# EAGLE design ShifterDial (EAGLE 9.6.2)
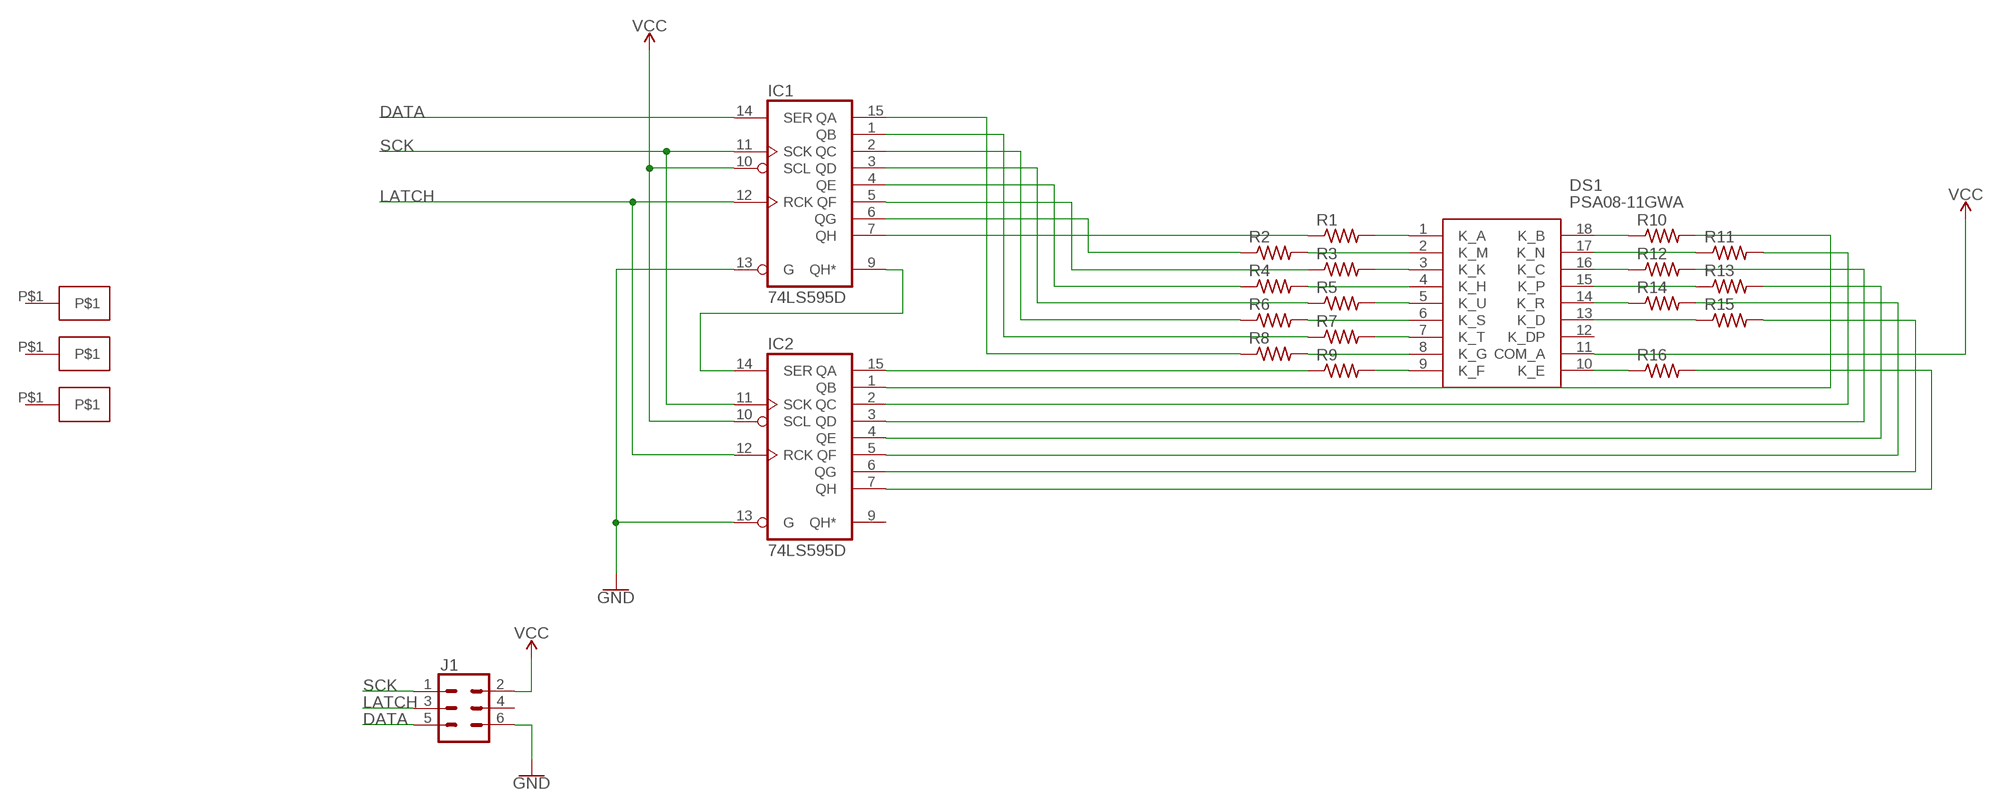
[diagram p0: schematic, sheet 1]

## Parts
DS1  PSA08-11GWA  [PSA0811GWA]
IC1  74LS595D  [SO16]
IC2  74LS595D  [SO16]
J1  CONN_03X2SHROUD  [2X3-SHROUDED]
R1  R-US_R0603  [R0603]
R2  R-US_R0603  [R0603]
R3  R-US_R0603  [R0603]
R4  R-US_R0603  [R0603]
R5  R-US_R0603  [R0603]
R6  R-US_R0603  [R0603]
R7  R-US_R0603  [R0603]
R8  R-US_R0603  [R0603]
R9  R-US_R0603  [R0603]
R10  R-US_R0603  [R0603]
R11  R-US_R0603  [R0603]
R12  R-US_R0603  [R0603]
R13  R-US_R0603  [R0603]
R14  R-US_R0603  [R0603]
R15  R-US_R0603  [R0603]
R16  R-US_R0603  [R0603]
U$1  KEYSTONEM3  [M3SMDSTANDOFF]
U$2  KEYSTONEM3  [M3SMDSTANDOFF]
U$3  KEYSTONEM3  [M3SMDSTANDOFF]

## Nets
DATA: IC1.14(SER) J1.5
GND: IC1.13(G) IC2.13(G) J1.6
LATCH: IC1.12(RCK) IC2.12(RCK) J1.3
N$1: IC1.9(QH*) IC2.14(SER)
N$2: DS1.1(K_A) R1.2
N$3: DS1.2(K_M) R2.2
N$4: DS1.3(K_K) R3.2
N$5: DS1.4(K_H) R4.2
N$6: DS1.5(K_U) R5.2
N$7: DS1.6(K_S) R6.2
N$8: DS1.7(K_T) R7.2
N$9: DS1.8(K_G) R8.2
N$10: DS1.9(K_F) R9.2
N$11: DS1.18(K_B) R10.1
N$12: DS1.17(K_N) R11.1
N$13: DS1.16(K_C) R12.1
N$14: DS1.15(K_P) R13.1
N$15: DS1.14(K_R) R14.1
N$16: DS1.13(K_D) R15.1
N$17: DS1.10(K_E) R16.1
N$18: IC1.7(QH) R1.1
N$19: IC1.6(QG) R2.1
N$20: IC1.5(QF) R3.1
N$21: IC1.4(QE) R4.1
N$22: IC1.3(QD) R5.1
N$23: IC1.2(QC) R6.1
N$24: IC1.1(QB) R7.1
N$25: IC1.15(QA) R8.1
N$26: IC2.6(QG) R15.2
N$27: IC2.7(QH) R16.2
N$28: IC2.1(QB) R10.2
N$29: IC2.2(QC) R11.2
N$30: IC2.3(QD) R12.2
N$31: IC2.4(QE) R13.2
N$32: IC2.5(QF) R14.2
N$34: IC2.15(QA) R9.1
SCK: IC1.11(SCK) IC2.11(SCK) J1.1
VCC: DS1.11(COM_A) IC1.10(SCL) IC2.10(SCL) J1.2
Unconnected: DS1.12(K_DP) IC2.9(QH*) J1.4 U$1.P$1 U$2.P$1 U$3.P$1

## Power pins joined to a net without a drawn wire
GND: IC1.8(GND) IC2.8(GND)
VCC: IC1.16(VCC) IC2.16(VCC)

## Library data of the parts
DS1 = PSA08-11GWA:PSA08-11GWA: LED Displays & Accessories AlphaNum Grn 568nm Common Anode Source: Datasheet <https://componentsearchengine.com/Datasheets/1/PSA08-11GWA.pdf>; DESCRIPTION: LED Displays & Accessories AlphaNum Grn 568nm Common Anode; HEIGHT: 8.75mm; MANUFACTURER_NAME: Kingbright; MANUFACTURER_PART_NUMBER: PSA08-11GWA; MOUSER_PART_NUMBER: 604-PSA08-11GWA; MOUSER_PRICE-STOCK: https://www.mouser.co.uk/ProductDetail/Kingbright/PSA08-11GWA?qs=VdjlWU%2FzoOGXetunvhrCIw%3D%3D
IC1 IC2 = 74xx-us:74*595: 8-bit SHIFT REGISTER, output latch
J1 = SparkFun-Connectors:CONN_03X2: Multi connection point. Often used as Generic Header-pin footprint for 0.1 inch spaced/style header connections You can populate with any combo of single row headers, but if you'd like an exact match, check these: Header - 2x3 (Male, 0.1") <https://www.sparkfun.com/products/12807> (PRT-12807) Header - 2x3 (Female, 0.1") <https://www.sparkfun.com/products/13010> (PRT-13010) 2x3 Pin Shrouded Header <https://www.sparkfun.com/products/10877> (PRT-10877) On any of the 0.1 inch spaced packages, you can populate with these: Break Away Headers - Straight <https://www.sparkfun.com/products/116> (PRT-00116) Break Away Male Headers - Right Angle <https://www.sparkfun.com/products/553> (PRT-00553) Female Headers <https://www.sparkfun.com/products/115> (PRT-00115) Break Away Headers - Machine Pin <https://www.sparkfun.com/products/117> (PRT-00117) Break Away Female Headers - Swiss Machine Pin <https://www.sparkfun.com/products/743> (PRT-00743) Special note: the shrouded connector mates well with our 3x2 ribbon cables: Ribbon Crimp Connector - 6-pin (2x3, Female) <https://www.sparkfun.com/products/10651> (PRT-10651) Ribbon Cable - 6 wire (15ft) <https://www.sparkfun.com/products/10646> (PRT-10646); PROD_ID: CONN-10681; SF_ID: PRT_10877
R1-R16 = rcl:R-US_: RESISTOR, American symbol; SPICEPREFIX: R
U$1-U$3 = KeystoneSMD:KEYSTONEM3

## Board
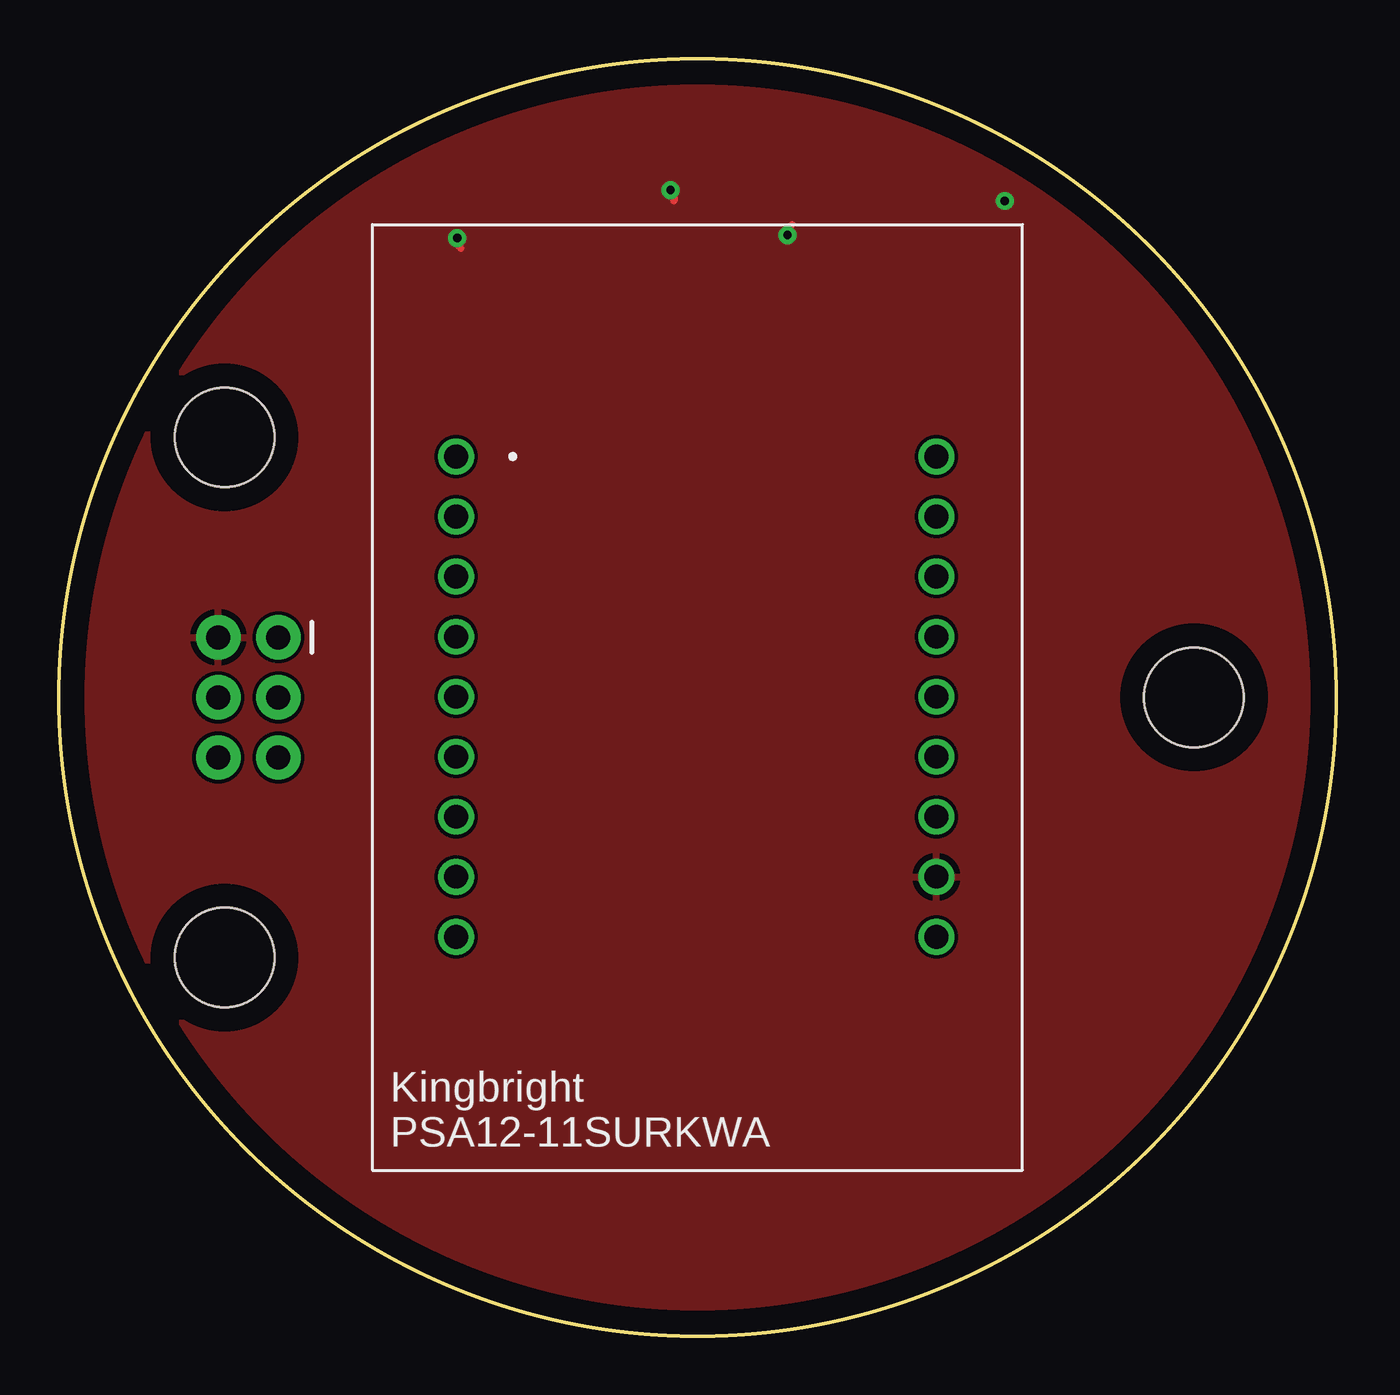
[diagram p1: board, top side]
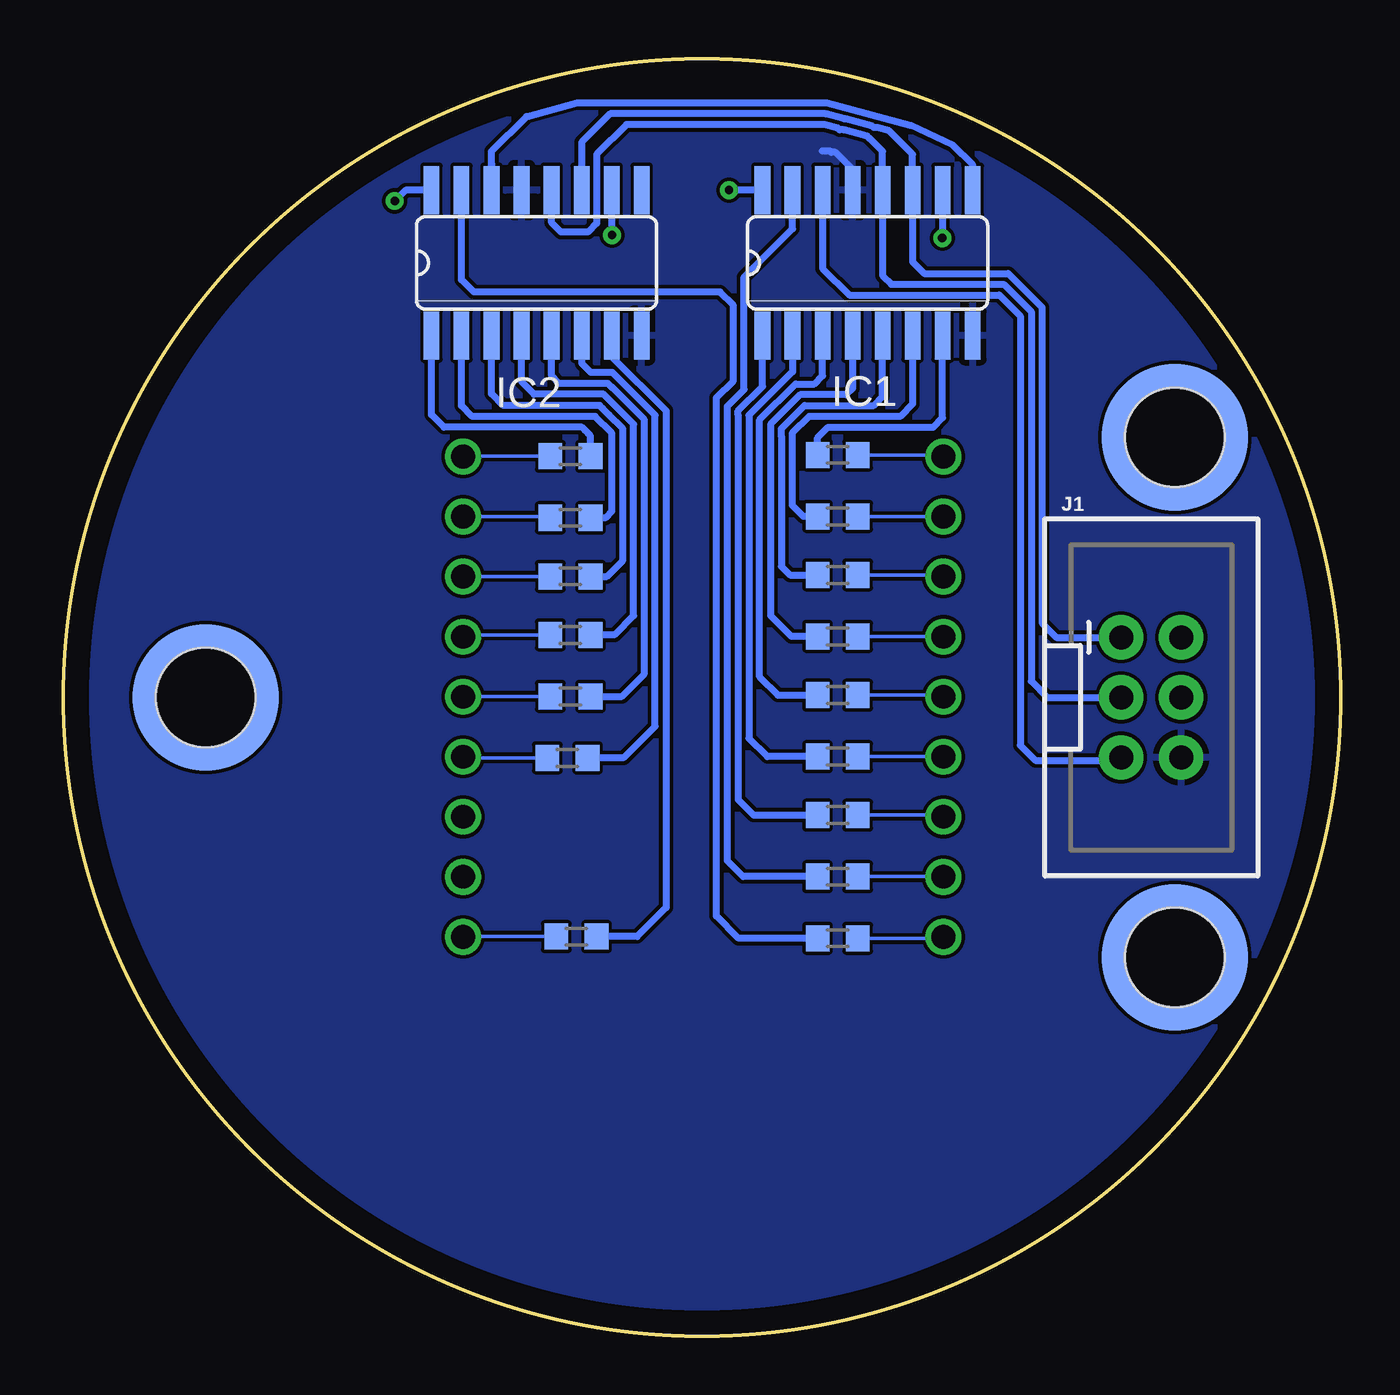
[diagram p2: board, bottom side, seen from below]

Size 54 x 54 mm. Coordinates in mm from the lower left corner, seen from the top.
Outline: circle at 27,27 radius 27
Copper layers (1*16): Top 0.035mm / dielectric 1.5mm / Bottom 0.035mm
Design rules "default *": minimum track width 12mil, minimum drill 0.35mm, track to track 6mil, track to pad 6mil, pad to pad 6mil, via to via 6mil, smd to smd 6mil, copper to edge 40mil, drill to drill 6mil, minimum pad ring 10mil, minimum via ring 8mil, stop-mask expansion 4mil, vias tented up to drill 0mil, thermal gap 10mil

### Footprints (pad centres in the part's own frame; a part is rotated, then mirrored left to right if it is on the bottom)
PSA0811GWA = drill 1 pad 1.5: 1 -10.21,10.19; 2 -10.21,7.65; 3 -10.21,5.11; 4 -10.21,2.57; 5 -10.21,0.03; 6 -10.21,-2.51; 7 -10.21,-5.05; 8 -10.21,-7.59; 9 -10.21,-10.13; 10 10.11,-10.13; 11 10.11,-7.59; 12 10.11,-5.05; 13 10.11,-2.51; 14 10.11,0.03; 15 10.11,2.57; 16 10.11,5.11; 17 10.11,7.65; 18 10.11,10.19
SO16 = smd 0.66 x 2.032: 1 -4.445,-3.073; 2 -3.175,-3.073; 3 -1.905,-3.073; 4 -0.635,-3.073; 5 0.635,-3.073; 6 1.905,-3.073; 7 3.175,-3.073; 8 4.445,-3.073; 9 4.445,3.073; 10 3.175,3.073; 11 1.905,3.073; 12 0.635,3.073; 13 -0.635,3.073; 14 -1.905,3.073; 15 -3.175,3.073; 16 -4.445,3.073
2X3-SHROUDED = drill 1.016 pad 1.88: 1 -1.27,2.54; 2 1.27,2.54; 3 -1.27,0; 4 1.27,0; 5 -1.27,-2.54; 6 1.27,-2.54
R0603 = smd 1 x 1.1: 1 -0.85,0; 2 0.85,0
M3SMDSTANDOFF = smd 6.2 x 6.2: P$1 0,0 | hole 4.2: 0,0

### Placement (x,y rotation side)
DS1  27,27 0 top
IC1  20,45.38 0 bottom
IC2  34,45.38 0 bottom
J1  8,27 0 bottom
R1  21.27,37.26 0 bottom
R2  21.27,34.66 0 bottom
R3  21.27,32.18 0 bottom
R4  21.27,29.58 0 bottom
R5  21.27,27.1 0 bottom
R6  21.27,24.5 0 bottom
R7  21.27,22.02 0 bottom
R8  21.27,19.42 0 bottom
R9  21.27,16.82 0 bottom
R10  32.57,37.2 0 bottom
R11  32.57,34.6 0 bottom
R12  32.57,32.12 0 bottom
R13  32.57,29.64 0 bottom
R14  32.57,27.04 0 bottom
R15  32.7,24.44 0 bottom
R16  32.31,16.88 0 bottom
U$1  7,38 0 bottom
U$2  7,16 0 bottom
U$3  48,27 0 bottom

### Tracks (layer width: path | path; a pad name or v marks a point on that pad's centre or on a via)
DATA
  Bottom 0.305: IC1.14 21.91,45.15 20.78,44.02 14.43,44.02 13.54,43.13 13.54,24.97 12.9,24.33 9.4,24.33 J1.5
GND
  Bottom 0.305: IC1.13 20.63,49.34 21.36,50.06 21.53,50.06 21.59,50.11 21.92,50.11
  pour Bottom: -3,57 29,57 30,58 52,58 57,53 60,50 60,3 55,-2 50,-2 1,-2 -5,4 -5,55
LATCH
  Bottom 0.305: J1.3 12.39,27 13.08,27.69 13.08,43.32 14.24,44.48 19,44.48 19.37,44.84 IC1.12 19.37,50.1 19.91,50.64 19.92,50.64 20.02,50.75 21.02,51.01 21.18,51.01 21.24,51.07 21.25,51.07 21.26,51.08 21.83,51.23 30.2,51.23 31.46,49.97 31.46,47.05 31.83,46.69 32.97,46.69 33.37,47.08 IC2.12
N$1
  Bottom 0.305: 15.55,48.97 IC1.9 15.55,49.53 16.39,50.36 18.19,51.2 21.71,52.15 32.29,52.15 34.43,51.57 35.91,50.1 IC2.14 35.91,49.59
N$2
  Bottom 0.152: R1.2 16.86,37.26 DS1.1
N$3
  Bottom 0.152: R2.2 DS1.2
N$4
  Bottom 0.152: R3.2 16.86,32.18 DS1.3
N$5
  Bottom 0.152: R4.2 DS1.4
N$6
  Bottom 0.152: R5.2 16.86,27.1 DS1.5
N$7
  Bottom 0.152: R6.2 DS1.6
N$8
  Bottom 0.152: R7.2 16.86,22.02 DS1.7
N$9
  Bottom 0.152: R8.2 DS1.8
N$10
  Bottom 0.152: R9.2 16.84,16.82 DS1.9
N$11
  Bottom 0.152: R10.1 DS1.18
N$12
  Bottom 0.152: R11.1 33.47,34.65 DS1.17
N$13
  Bottom 0.152: R12.1 37.1,32.12 DS1.16
N$14
  Bottom 0.152: R13.1 37.03,29.64 DS1.15
N$15
  Bottom 0.152: R14.1 37.1,27.04 DS1.14
N$16
  Bottom 0.152: R15.1 37.06,24.44 DS1.13
N$17
  Bottom 0.152: R16.1 37.1,16.88 DS1.10
N$18
  Bottom 0.305: R1.1 22.12,37.98 21.67,38.43 17.22,38.43 16.82,38.83 IC1.7
N$19
  Bottom 0.305: R2.1 22.72,34.66 23.19,35.13 23.19,38.18 22.48,38.89 18.62,38.89 18.09,39.41 IC1.6
N$20
  Bottom 0.305: R3.1 23.29,32.18 23.65,32.54 23.65,38.05 23.65,38.37 22.67,39.34 19.74,39.34 19.37,39.72 IC1.5
N$21
  Bottom 0.305: R4.1 23.23,29.58 24.1,30.45 24.1,38.55 22.86,39.8 20.9,39.8 20.63,40.07 IC1.4
N$22
  Bottom 0.305: R5.1 23.8,27.1 24.56,27.86 24.56,38.74 23.05,40.26 22.25,40.26 21.91,40.6 IC1.3
N$23
  Bottom 0.305: R6.1 24.24,24.5 25.02,25.27 25.02,38.93 23.18,40.78 IC1.2
N$24
  Bottom 0.305: R7.1 24.82,22.02 25.48,22.68 25.48,38.94 25.48,39.12 24.45,40.15 IC1.1
N$25
  Bottom 0.305: R8.1 25.26,19.42 25.93,20.09 25.93,38.94 25.93,39.31 25.22,40.02 25.22,44.78 23.18,46.83 IC1.15
N$26
  Bottom 0.305: R15.2 30.32,24.44 28.98,25.78 28.98,38.93 30.79,40.74 31.7,40.74 32.08,41.12 32.08,42.29 IC2.6
N$27
  Bottom 0.305: IC2.7 30.82,41.42 28.52,39.12 28.52,18.11 29.75,16.88 R16.2
N$28
  Bottom 0.305: R10.2 31.72,38.07 31.83,38.18 31.95,38.3 32.08,38.43 37.92,38.43 38.45,38.95 IC2.1
N$29
  Bottom 0.305: R11.2 31.09,34.6 30.81,34.87 30.81,38.18 31.52,38.89 36.73,38.89 37.17,39.33 IC2.2
N$30
  Bottom 0.305: R12.2 31.02,32.12 30.35,32.79 30.35,38.37 30.93,38.94 31.2,39.22 31.33,39.34 35.41,39.34 35.91,39.84 IC2.3
N$31
  Bottom 0.305: R13.2 30.7,29.64 29.9,30.45 29.9,38.55 31.17,39.83 34.11,39.83 34.63,40.35 IC2.4
N$32
  Bottom 0.305: R14.2 30.39,27.04 29.44,27.99 29.44,38.74 30.79,40.1 30.83,40.13 30.98,40.28 33.05,40.28 33.37,40.6 IC2.5
N$34
  Bottom 0.305: R9.1 25.45,16.82 26.39,17.75 26.39,39.67 25.68,40.39 25.68,43.59 26.24,44.14 36.65,44.14 37.17,44.67 IC2.15
SCK
  Bottom 0.305: J1.1 12.01,29.54 12.62,30.15 12.62,43.51 14.05,44.93 17.6,44.93 18.09,45.42 IC1.11 18.09,49.97 19.09,50.97 19.58,51.1 19.73,51.1 19.79,51.16 20.96,51.47 20.99,51.47 21,51.48 21.77,51.69 30.89,51.69 32.09,50.48 IC2.11
VCC  (via drill 0.35)
  Top 0.305: v25.86,48.46 26,48.32 26,48 | v30.81,46.56 30.81,46.81 31,47 | v16.84,46.43 16.84,46.16 17,46
  Bottom 0.305: IC1.16 25.85,48.45 v25.86,48.46 | IC2.16 39.55,48.45 v40,48 | IC2.10 30.82,46.57 v30.81,46.56 | IC1.10 16.82,46.45 v16.84,46.43
  pour Top: -4,56 58,56 58,-1 -1,-1 -4,2